# Altium project FMC_ADC_100M_10B_16CHA_TDC.PrjPCB (part 2 of 5)

## Sheet Clock_circuit.SchDoc: FMC_ADC
size 420 x 297 mm; Author: G.Kasprowicz; CompanyName: WUT ISE; DrawnBy: G.Kasprowicz; Organization: WUT ISE; Address1: PW ISE; Address2: Nowowiejska 15/19 00-665 Warsaw; Address3: gkasprow@gmail.com; Revision: 2; SheetNumber: -; SheetTotal: -; ModifiedBy: -; CheckedDate: -; Title2: Clock distribution; DivGrp: WUT ISE; Designer: G.Kasprowicz; ModifiedDate: -; ProjectName: Sensor Box
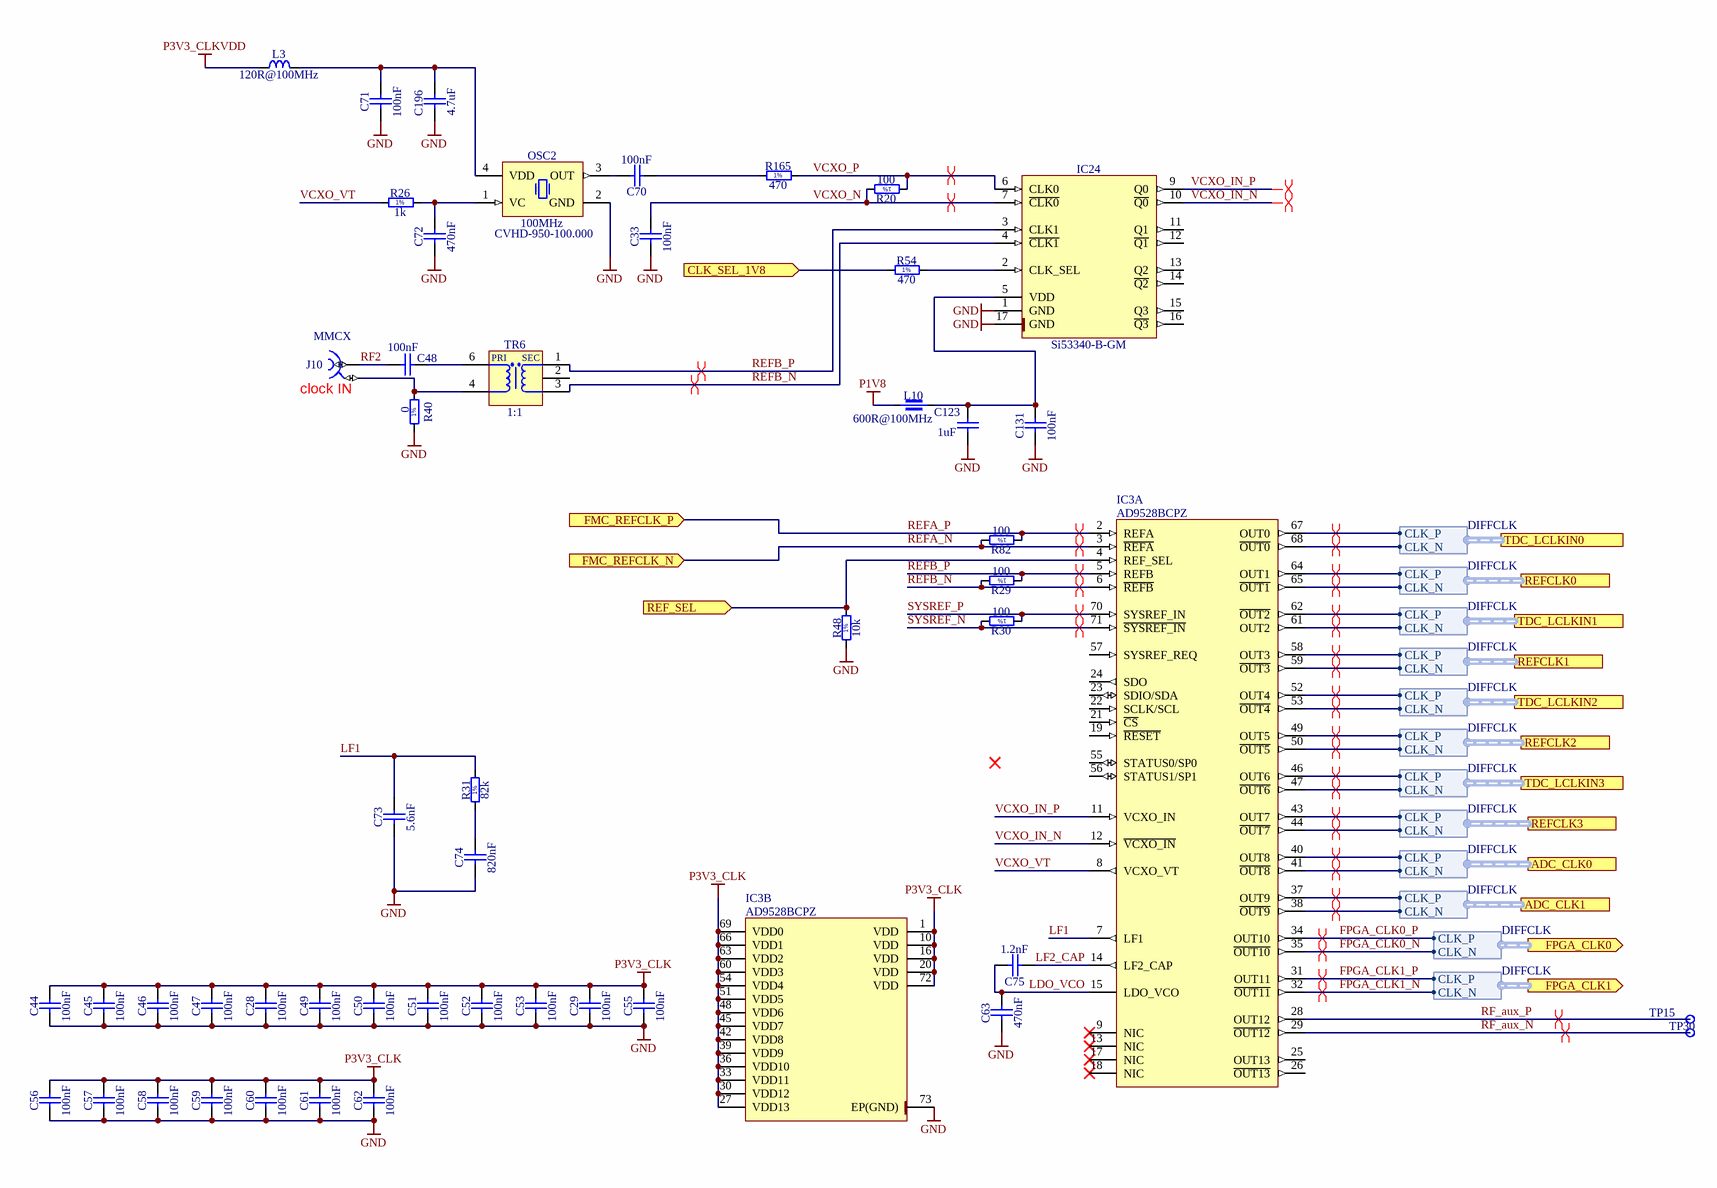
[diagram p3: Clock_circuit.SchDoc]

### Parts
C28  100nF  [CAPC0603X33N]
C29  100nF  [CAPC0603X33N]
C33  100nF  [CAPC0603X33N]
C44  100nF  [CAPC0603X33N]
C45  100nF  [CAPC0603X33N]
C46  100nF  [CAPC0603X33N]
C47  100nF  [CAPC0603X33N]
C48  100nF  [CAPC0603X33N]
C49  100nF  [CAPC0603X33N]
C50  100nF  [CAPC0603X33N]
C51  100nF  [CAPC0603X33N]
C52  100nF  [CAPC0603X33N]
C53  100nF  [CAPC0603X33N]
C55  100nF  [CAPC0603X33N]
C56  100nF  [CAPC0603X33N]
C57  100nF  [CAPC0603X33N]
C58  100nF  [CAPC0603X33N]
C59  100nF  [CAPC0603X33N]
C60  100nF  [CAPC0603X33N]
C61  100nF  [CAPC0603X33N]
C62  100nF  [CAPC0603X33N]
C63  470nF  [CAPC1005X55N]
C70  100nF  [CAPC0603X33N]
C71  100nF  [CAPC0603X33N]
C72  470nF  [CAPC1005X55N]
C73  5.6nF  [CAPC2012X88N]
C74  820nF  [CAPC3216X130N]
C75  1.2nF  [CAPC1608X80N]
C123  1uF  [CAPC1005X55N]
C131  100nF  [CAPC0603X33N]
C196  4.7uF  [CAPC1608X87N]
IC3  AD9528BCPZ  [QFN50P1000X1000X100-73N-S545]  (parts A,B of 2)
IC24  Si53340-B-GM  [QFN50P300X300X90-17N-S175]
J10  Family: MMCX  [HUBER-SUHNER_85_MMCX-50-0-1/111 OH]  (hidden comment: Coax_1Female_1Shield)
L3  120R@100MHz  [INDC1608X65N]
L10  600R@100MHz  [INDC1005X55N]
OSC2  100MHz  Manufacturer Part Number: CVHD-950-100.000  [OSC_CRYSTEK_CVHD-950]
R20  100  [RESC0603X28N]
R26  1k  [RESC1005X40N]
R29  100  [RESC0603X28N]
R30  100  [RESC0603X28N]
R31  82k  [RESC1005X40N]
R40  0  [RESC1005X40N]
R48  10k  [RESC1005X40N]
R54  470  [RESC1005X40N]
R82  100  [RESC0603X28N]
R165  470  [RESC1005X40N]
TP15  Test Point  [TPS62]  (value not drawn)
TP30  Test Point  [TPS62]  (value not drawn)
TR6  1:1  [XFMR_MINI-CIRCUITS_AT224-1]

### Ports
ADC_CLK0 (harness DIFFCLK), ADC_CLK1 (harness DIFFCLK), CLK_SEL_1V8 (in), FMC_REFCLK_N (in), FMC_REFCLK_P (in), FPGA_CLK0 (out, harness DIFFCLK), FPGA_CLK1 (out, harness DIFFCLK), REF_SEL (in), REFCLK0 (harness DIFFCLK), REFCLK1 (harness DIFFCLK), REFCLK2 (harness DIFFCLK), REFCLK3 (harness DIFFCLK), TDC_LCLKIN0 (harness DIFFCLK), TDC_LCLKIN1 (harness DIFFCLK), TDC_LCLKIN2 (harness DIFFCLK), TDC_LCLKIN3 (harness DIFFCLK)

### Harnesses
DIFFCLK: CLK_P, CLK_N

### Nets
GND: C28.1 C29.1 C33.1 C44.1 C45.1 C46.1 C47.1 C49.1 C50.1 C51.1 C52.1 C53.1 C55.1 C56.1 C57.1 C58.1 C59.1 C60.1 C61.1 C62.1 C63.1 C71.1 C72.1 C73.1 C74.1 C123.1 C131.1 C196.1 IC3.73(EP(GND)) IC24.1(GND) IC24.17(GND) OSC2.2(GND) R40.1 R48.1
P1V8: L10.1
P3V3_CLK: C28.2 C29.2 C44.2 C45.2 C46.2 C47.2 C49.2 C50.2 C51.2 C52.2 C53.2 C55.2 C56.2 C57.2 C58.2 C59.2 C60.2 C61.2 C62.2 IC3.1(VDD) IC3.10(VDD) IC3.16(VDD) IC3.20(VDD) IC3.27(VDD13) IC3.30(VDD12) IC3.33(VDD11) IC3.36(VDD10) IC3.39(VDD9) IC3.42(VDD8) IC3.45(VDD7) IC3.48(VDD6) IC3.51(VDD5) IC3.54(VDD4) IC3.60(VDD3) IC3.63(VDD2) IC3.66(VDD1) IC3.69(VDD0) IC3.72(VDD)
P3V3_CLKVDD: L3.1
ADC_CLK_N: IC3.41(~{OUT8}) ; port ADC_CLK0.CLK_N
ADC_CLK_N: IC3.38(~{OUT9}) ; port ADC_CLK1.CLK_N  [a separate net that carries the same name]
ADC_CLK_P: IC3.40(OUT8) ; port ADC_CLK0.CLK_P
ADC_CLK_P: IC3.37(OUT9) ; port ADC_CLK1.CLK_P  [a separate net that carries the same name]
FPGA_CLK0_N: IC3.35(~{OUT10}) ; port FPGA_CLK0.CLK_N  [project net CLK1_M2C_N]
FPGA_CLK0_P: IC3.34(OUT10) ; port FPGA_CLK0.CLK_P  [project net CLK1_M2C_P]
FPGA_CLK1_N: IC3.32(~{OUT11}) ; port FPGA_CLK1.CLK_N  [project net CLK0_M2C_N]
FPGA_CLK1_P: IC3.31(OUT11) ; port FPGA_CLK1.CLK_P  [project net CLK0_M2C_P]
LCLKIN_N: IC3.68(~{OUT0}) ; port TDC_LCLKIN0.CLK_N
LCLKIN_N: IC3.47(~{OUT6}) ; port TDC_LCLKIN3.CLK_N  [a separate net that carries the same name]
LCLKIN_N: IC3.53(~{OUT4}) ; port TDC_LCLKIN2.CLK_N  [a separate net that carries the same name]
LCLKIN_N: IC3.61(OUT2) ; port TDC_LCLKIN1.CLK_N  [a separate net that carries the same name]
LCLKIN_P: IC3.67(OUT0) ; port TDC_LCLKIN0.CLK_P
LCLKIN_P: IC3.46(OUT6) ; port TDC_LCLKIN3.CLK_P  [a separate net that carries the same name]
LCLKIN_P: IC3.52(OUT4) ; port TDC_LCLKIN2.CLK_P  [a separate net that carries the same name]
LCLKIN_P: IC3.62(~{OUT2}) ; port TDC_LCLKIN1.CLK_P  [a separate net that carries the same name]
LDO_VCO: C63.2 C75.2 IC3.15(LDO_VCO)
LF1: C73.2 IC3.7(LF1) R31.2
LF2_CAP: C75.1 IC3.14(LF2_CAP)
REFA_N: IC3.3(~{REFA}) R82.2 ; port FMC_REFCLK_N
REFA_P: IC3.2(REFA) R82.1 ; port FMC_REFCLK_P
REFB_N: IC3.6(~{REFB}) IC24.4(~{CLK1}) R29.2 TR6.3(S)
REFB_P: IC3.5(REFB) IC24.3(CLK1) R29.1 TR6.1(SDOT)
REFCLK_N: IC3.65(~{OUT1}) ; port REFCLK0.CLK_N
REFCLK_N: IC3.44(~{OUT7}) ; port REFCLK3.CLK_N  [a separate net that carries the same name]
REFCLK_N: IC3.50(~{OUT5}) ; port REFCLK2.CLK_N  [a separate net that carries the same name]
REFCLK_N: IC3.59(~{OUT3}) ; port REFCLK1.CLK_N  [a separate net that carries the same name]
REFCLK_P: IC3.64(OUT1) ; port REFCLK0.CLK_P
REFCLK_P: IC3.43(OUT7) ; port REFCLK3.CLK_P  [a separate net that carries the same name]
REFCLK_P: IC3.49(OUT5) ; port REFCLK2.CLK_P  [a separate net that carries the same name]
REFCLK_P: IC3.58(OUT3) ; port REFCLK1.CLK_P  [a separate net that carries the same name]
RF2: C48.2 J10.1
RF_aux_N: IC3.29(~{OUT12}) TP30.1
RF_aux_P: IC3.28(OUT12) TP15.1
SYSREF_N: IC3.71(~{SYSREF_IN}) R30.2
SYSREF_P: IC3.70(SYSREF_IN) R30.1
VCXO_IN_N: IC3.12(~{VCXO_IN}) IC24.10(~{Q0})
VCXO_IN_P: IC3.11(VCXO_IN) IC24.9(Q0)
VCXO_N: C33.2 IC24.7(~{CLK0}) R20.2
VCXO_P: IC24.6(CLK0) R20.1 R165.2
VCXO_VT: IC3.8(VCXO_VT) R26.1
NetC48_1: C48.1 TR6.6(PDOT)
NetC70_1: C70.1 R165.1
NetC70_2: C70.2 OSC2.3(OUT)
NetC71_2: C71.2 C196.2 L3.2 OSC2.4(VDD)
NetC72_2: C72.2 OSC2.1(VC) R26.2
NetC74_2: C74.2 R31.1
NetC123_2: C123.2 C131.2 IC24.5(VDD) L10.2
NetIC3_4: IC3.4(REF_SEL) R48.2 ; port REF_SEL
NetIC24_2: IC24.2(CLK_SEL) R54.2
NetIC27_8: R54.1 ; port CLK_SEL_1V8
NetJ10_2: J10.2 R40.2 TR6.4(P)

Not connected (* = marked no-connect by the designer): IC3 9(NIC)* 13(NIC)* 17(NIC)* 18(NIC)* 19(~{RESET}) 21(~{CS}) 22(SCLK/SCL) 23(SDIO/SDA) 24(SDO) 25(OUT13) 26(~{OUT13}) 55(STATUS0/SP0) 56(STATUS1/SP1) 57(SYSREF_REQ); IC24 11(Q1) 12(~{Q1}) 13(Q2) 14(~{Q2}) 15(Q3) 16(~{Q3}); TR6 2(NU)

### Layout directives
differential pair: ADC_CLK_N, ADC_CLK_P, CLK0_M2C_N, CLK0_M2C_P, CLK1_M2C_N, CLK1_M2C_P, LCLKIN_N, LCLKIN_P, REFA_N, REFA_P, REFB_N, REFB_P, REFCLK_N, REFCLK_P, RF_aux_N, RF_aux_P, SYSREF_N, SYSREF_P, VCXO_IN_N, VCXO_IN_P, VCXO_N, VCXO_P

### Notes on the sheet
- (near J10) clock IN
- Project/Equipment
- Document
- Designer
- Drawn by
- Check.by
- Copyright WUT ISE 2018.
  This documentation describes Open Hardware and is licensed under the CERN OHL v.1.1. You may redistribute and modify this documentation under the terms of the CERN OHL v.1.1. (http://ohwr.org/CERNOHL). This documentation is distributed WITHOUT ANY EXPRESS OR IMPLIED WARRANTY, INCLUDING OF MERCHANTABILITY, SATISFACTORY QUALITY AND FITNESS FOR A PARTICULAR PURPOSE. Please see the CERN OHL v.1.1 for applicable conditions.
- Contact
- File
- Last Mod.
- Print Date
- Sheet
- Size
- A3
- of
- Rev
- (in symbol R0201_100R_1%_0.05W_200PPM) 1%
- (in symbol R0402_0R_JUMPER) 1%
- (in symbol R0402_1K_1%_0.0625W_100PPM) 1%
- (in symbol R0402_10K_1%_0.0625W_100PPM) 1%
- (in symbol R0402_82K_1%_0.0625W_100PPM) 1%
- (in symbol R0402_470R_1%_0.0625W_100PPM) 1%
- (in symbol XFMR_MINI-CIRCUITS_TC1-1+) PRI; SEC

### Library data of the parts
C28 C29 C33 C44-C47 C49-C53 C55-C62 C70 C71 = CC0201_100NF_6.3V_10%_X5R: Non-polarised capacitor; Part Description: SMD Multilayer Chip Ceramic Capacitor; Manufacturer: GENERIC; Manufacturer1 Part Number: 02016D104KAT2A; Tolerance: ±10%; Voltage: 6.3V; TC: X5R; Value: 100nF; Part Number: CC0201_100NF_6.3V_10%_X5R; Component Kind: Standard; Component Type: Standard; Pin Count: 2; Status: Not Recommended; Manufacturer Part Number: CC0201_100NF_6.3V_10%_X5R; Case: 0201; Mounted: Yes; Socket: No; SMD: Yes; Sense: No; Manufacturer1 Example: AVX; Manufacturer1 ComponentHeight: 0.33mm; HelpURL: \\cern.ch\dfs\Applications\Altium\Datasheets\CC0201_X5R_AVX.pdf; Author: CERN DEM JLC; CreateDate: 03.12.2007; LatestRevisionDate: 03.12.2007
C48 = CC0201_100NF_6.3V_10%_X5R: Non-polarised capacitor; Part Description: SMD Multilayer Chip Ceramic Capacitor; Manufacturer: GENERIC; Manufacturer1 Part Number: 02016D104KAT2A; Voltage: 6.3V; TC: X5R; Tolerance: ±10%; Table: Capacitors SMD; Part Number: CC0201_100NF_6.3V_10%_X5R; Component Kind: Standard; Component Type: Standard; Pin Count: 2; Value: 100nF; Status: Not Recommended; Manufacturer Part Number: CC0201_100NF_6.3V_10%_X5R; Case: 0201; Mounted: Yes; Socket: No; SMD: Yes; Manufacturer1 Example: AVX; Manufacturer1 ComponentHeight: 0.33mm; HelpURL: \\cern.ch\dfs\Applications\Altium\Datasheets\CC0201_X5R_AVX.pdf; Author: CERN DEM JLC; CreateDate: 2007-12-03; LatestRevisionDate: 2007-12-03
C63 C72 = CC0402_470NF_6.3V_10%_X5R: Non-polarised capacitor; Part Description: SMD Multilayer Chip Ceramic Capacitor; Manufacturer: GENERIC; Manufacturer1 Part Number: GRM155R60J474KE19D; Tolerance: ±10%; Voltage: 6.3V; TC: X5R; Value: 470nF; Part Number: CC0402_470NF_6.3V_10%_X5R; Component Kind: Standard; Component Type: Standard; Pin Count: 2; Status: Preferred; Manufacturer Part Number: CC0402_470NF_6.3V_10%_X5R; Case: 0402; Mounted: Yes; Socket: No; SMD: Yes; Sense: No; Manufacturer1 Example: MURATA; Manufacturer1 ComponentHeight: 0.55mm; HelpURL: \\cern.ch\dfs\Applications\Altium\Datasheets\CC0402_X5R_MURATA_GRM.pdf; Author: CERN DEM JLC; CreateDate: 22.04.2010; LatestRevisionDate: 22.04.2010
C73 = CC0805_5.6NF_50V_5%_C0G: Non-polarised capacitor; Part Description: SMD Multilayer Chip Ceramic Capacitor; Manufacturer: GENERIC; Manufacturer1 Part Number: GRM2195C1H562JA01D; Voltage: 50V; TC: C0G/NP0; Tolerance: ±5%; Part Number: CC0805_5.6NF_50V_5%_C0G; Component Kind: Standard; Component Type: Standard; Pin Count: 2; Value: 5.6nF; Status: Preferred; Manufacturer Part Number: CC0805_5.6NF_50V_5%_C0G; Case: 0805; Mounted: Yes; Socket: No; SMD: Yes; Sense: No; Manufacturer1 Example: Murata; Manufacturer1 ComponentHeight: 0.85mm; Author: *
C74 = CC1206_820NF_25V_10%_X7R: Non-polarised capacitor; Part Description: SMD Multilayer Chip Ceramic Capacitor; Manufacturer: GENERIC; Manufacturer1 Part Number: 12063C824KAT2A; Voltage: 25V; TC: X7R; Tolerance: ±10%; Part Number: CC1206_820NF_25V_10%_X7R; Component Kind: Standard; Component Type: Standard; Pin Count: 2; Value: 820nF; Manufacturer Part Number: CC1206_820NF_25V_10%_X7R; Case: 1206; Mounted: Yes; Socket: No; SMD: Yes; Sense: No; Manufacturer1 ComponentHeight: 1.25mm; Manufacturer1 Example: AVX
C75 = CC0603_1.2NF_50V_5%_C0G: Non-polarised capacitor; Part Description: SMD Multilayer Chip Ceramic Capacitor; Manufacturer: GENERIC; Manufacturer1 Part Number: C0603C122J5GACTU; Tolerance: ±5%; Voltage: 50V; TC: C0G/NP0; Value: 1.2nF; Part Number: CC0603_1.2NF_50V_5%_C0G; Component Kind: Standard; Component Type: Standard; Pin Count: 2; Status: Preferred; Manufacturer Part Number: CC0603_1.2NF_50V_5%_C0G; Case: 0603; Mounted: Yes; Socket: No; SMD: Yes; Sense: No; Manufacturer1 Example: KEMET; Manufacturer1 ComponentHeight: 0.8mm; Author: *
C123 = CC0402_1UF_16V_10%_X5R: Non-polarised capacitor; Part Description: SMD Multilayer Chip Ceramic Capacitor; Manufacturer: GENERIC; Manufacturer1 Part Number: C1005X5R1C105KT; Voltage: 16V; TC: X5R; Tolerance: ±10%; Part Number: CC0402_1UF_16V_10%_X5R; Component Kind: Standard; Component Type: Standard; Pin Count: 2; Value: 1uF; Status: Preferred; Manufacturer Part Number: CC0402_1UF_16V_10%_X5R; Case: 0402; Mounted: Yes; Socket: No; SMD: Yes; Sense: No; Manufacturer1 Example: TDK; Manufacturer1 ComponentHeight: 0.55mm; HelpURL: \\cern.ch\dfs\Applications\Altium\Datasheets\CC0402_X5R_TDK_C.pdf; Author: CERN DEM JLC; CreateDate: 2012-10-25; LatestRevisionDate: 2012-10-25
C131 = CC0201_100NF_6.3V_10%_X5R: as C1 on sheet ADC; Part Number: CC0201_100NF_6.3V_10%_X5R; Component Kind: Standard; Component Type: Standard; Pin Count: 2; Value: 100nF; Status: Not Recommended; Manufacturer Part Number: CC0201_100NF_6.3V_10%_X5R; Case: 0201; Mounted: Yes; Socket: No; SMD: Yes; Sense: No; Manufacturer1 Example: AVX; Manufacturer1 ComponentHeight: 0.33mm; HelpURL: \\cern.ch\dfs\Applications\Altium\Datasheets\CC0201_X5R_AVX.pdf; Author: CERN DEM JLC; CreateDate: 03.12.2007; LatestRevisionDate: 03.12.2007
C196 = CC0603_4.7UF_6.3V_10%_X5R: Non-polarised capacitor; Part Description: SMD Multilayer Chip Ceramic Capacitor; Manufacturer: GENERIC; Manufacturer1 Part Number: 225520613672; Voltage: 6.3V; TC: X5R; Tolerance: ±10%; Part Number: CC0603_4.7UF_6.3V_10%_X5R; Component Kind: Standard; Component Type: Standard; Pin Count: 2; Value: 4.7uF; Status: Preferred; Manufacturer Part Number: CC0603_4.7uF_6.3V_10%_X5R; Case: 0603; Mounted: Yes; Socket: No; SMD: Yes; Manufacturer1 Example: PHYCOMP; Manufacturer1 ComponentHeight: 0.87mm; HelpURL: \\cern.ch\dfs\Applications\Altium\Datasheets\CC0805_X5R_PHYCOMP_HC.pdf; Author: CERN DEM JLC; CreateDate: 03.12.2007; LatestRevisionDate: 03.12.2007; Sense: No
IC3 = AD9528BCPZ: Clock Generator with 14 LVDS/HSTL Outputs; Manufacturer: ANALOG DEVICES; PressFit: No; Bonding: No; Part Number: AD9528BCPZ; Component Kind: Standard; Component Type: Standard; Device: AD9528BCPZ; PackageDescription: QFN,0.50mm Pitch, Square;72 Pin,10.00mm L X 10.00mm W X 1.00mm H Body (W/Thermal Tab 5.45mm X 5.45mm), IPC Medium Density; Part Description: Clock Generator with 14 LVDS/HSTL Outputs; Manufacturer Part Number: AD9528BCPZ; Pin Count: 73; Case: QFN72; Mounted: Yes; Socket: No; SMD: Yes; Sense: No; ComponentHeight: 1mm; HelpURL: \\cern.ch\dfs\Applications\Altium\Datasheets\AD9528BCPZ.pdf; Author: CERN DEM JLC; CreateDate: 11.10.2016; LatestRevisionDate: 11.10.2016
IC24 = Si53340-B-GM: Low-Jitter LVDS Fanout Clock Buffers, 10-Output,  Any-Input, Any-Frequency up to 1250MHz; Manufacturer: SILICON LABS; PressFit: No; Bonding: No; Part Number: Si53340-B-GM; Component Kind: Standard; Component Type: Standard; Device: Si53340-B-GM; PackageDescription: QFN, 0.50mm Pitch, Square; 16 Pin, 3.00mm L X 3.00mm W X 0.90mm H Body (w/thermal tab 1.75mm x 1.75mm), IPC Medium Density; Part Description: Low-Jitter LVDS Fanout Clock Buffers, 10-Output,  Any-Input, Any-Frequency up to 1250MHz; Manufacturer Part Number: Si53340-B-GM; Pin Count: 17; Case: QFN16; Mounted: Yes; Socket: No; SMD: Yes; Sense: No; ComponentHeight: 0.9mm; HelpURL: \\cern.ch\dfs\Applications\Altium\Datasheets\Si53340-B-GM.pdf; Author: CERN DEM MR; CreateDate: 04.09.2017; LatestRevisionDate: 04.09.2017
J10 = HUBER-SUHNER_85_MMCX-50-0-1/111 OH: Part Description: MMCX 50 Ohms Right Angle PCB Jack; Manufacturer: HUBER+SUHNER; Table: Miscellaneous; Part Number: HUBER-SUHNER_85_MMCX-50-0-1/111 OH; Component Kind: Standard; Component Type: Standard; Pin Count: 2; Mounted: Yes; Socket: No; SMD: No; Status: None; Manufacturer Part Number: 85_MMCX-50-0-1/111 OH; ComponentHeight: 9.6mm; HelpURL: \\cern.ch\dfs\Applications\Altium\Datasheets\HUBER-SUHNER_85_MMCX-50-0-1-111 OH.pdf; Author: CERN DEM JLC; CreateDate: 2011-10-04; LatestRevisionDate: 2011-10-04
L3 = IND0603_MURATA_BLM18SG121TN1D: Inductor; Part Description: SMD EMIFIL Suppression Chip Ferrite Bead; Manufacturer: MURATA; Power: 3A; Resistance: 0.025R; Tolerance: ±25%; Part Number: IND0603_MURATA_BLM18SG121TN1D; Component Kind: Standard; Component Type: Standard; Pin Count: 2; Value: 120R@100MHz; Status: None; Manufacturer Part Number: BLM18SG121TN1D; Case: 0603; Mounted: Yes; Socket: No; SMD: Yes; Sense: No; ComponentHeight: 0.65mm; HelpURL: \\cern.ch\dfs\Applications\Altium\Datasheets\IND0603_MURATA_BLM18S.pdf; Author: CERN DEM JLC; CreateDate: 23.07.2014; LatestRevisionDate: 23.07.2014
L10 = IND0402_MURATA_BLM15HD601SN1: Part Description: SMD EMIFIL Suppression Chip Ferrite Bead; Manufacturer: MURATA; Manufacturer Part Number: BLM15HD601SN1D; Power: 300mA; Resistance: 0.85R; Tolerance: ±25%; Part Number: IND0402_MURATA_BLM15HD601SN1; Component Kind: Standard; Component Type: Standard; Pin Count: 2; Value: 600R@100MHz; Status: None; Case: 0402; Mounted: Yes; Socket: No; SMD: Yes; Sense: No; ComponentHeight: 0.55mm; HelpURL: \\cern.ch\dfs\Applications\Altium\Datasheets\IND0402_MURATA_BLM15H.pdf; Author: CERN DEM JLC; CreateDate: 28.02.2012; LatestRevisionDate: 25.10.2018
OSC2 = OSC_125MHZ_CRYSTEK_CVHD-950-100.000: Oscillator 4 pins 1=VC 2=GND 3=OUT 4=VDD; Part Description: 3.3V, ±20ppm, 15pF, 0..70°C, CMOS Surface Mount Ultra-Low Noise Oscillator (CVHD-950 Series); Manufacturer: CRYSTEK CRYSTAL; PressFit: No; Bonding: No; Part Number: OSC_125MHZ_CRYSTEK_CVHD-950-100.000; Component Kind: Standard; Component Type: Standard; PackageDescription: Oscillator, 5.08mm Pitch; 4 Pin, 14.2mm L X 9.14mm W X 5.3mm H, CVHD-950 Serie; Value: 100MHz; Pin Count: 4; Mounted: Yes; Socket: No; SMD: Yes; ComponentHeight: 5.3mm; HelpURL: \\cern.ch\dfs\Applications\Altium\Datasheets\OSC_CRYSTEK_CVHD-950.pdf; Author: CERN DEM JLC; CreateDate: 09.10.2012; LatestRevisionDate: 09.10.2012; Sense: No
R20 R29 R30 R82 = R0201_100R_1%_0.05W_200PPM: Resistor - 1%; Part Description: Thick Film Chip Resistor; Manufacturer: GENERIC; Manufacturer1 Part Number: CRCW0201100RFNED; Power: 0.05W; TC: ±200ppm/°C; PressFit: No; Part Number: R0201_100R_1%_0.05W_200PPM; Component Kind: Standard; Component Type: Standard; Pin Count: 2; Value: 100; Status: Not Recommended; Tolerance: ±1%; Manufacturer Part Number: R0201_100R_1%_0.05W_200PPM; Case: 0201; Mounted: Yes; Socket: No; SMD: Yes; Manufacturer1 Example: VISHAY; Manufacturer1 ComponentHeight: 0.27mm; HelpURL: \\cern.ch\dfs\Applications\Altium\Datasheets\R0201_VISHAY_CRCW0201 e3.pdf; Author: CERN DEM JLC; CreateDate: 13.11.2014; LatestRevisionDate: 13.11.2014; Sense: No
R26 = R0402_1K_1%_0.0625W_100PPM: Resistor - 1%; Part Description: General Purpose Thick Film Chip Resistor; Manufacturer: GENERIC; Manufacturer1 Part Number: 232270671002L; TC: ±100ppm/°C; Tolerance: ±1%; Value: 1k; Power: 0.0625W; Part Number: R0402_1K_1%_0.0625W_100PPM; Component Kind: Standard; Component Type: Standard; Pin Count: 2; Status: Not recommended; Manufacturer Part Number: R0402_1K_1%_0.0625W_100PPM; Case: 0402; Mounted: Yes; Sense: No; Socket: No; SMD: Yes; Manufacturer1 Example: YAGEO PHYCOMP; Manufacturer1 ComponentHeight: 0.4mm; HelpURL: \\cern.ch\dfs\Applications\Altium\Datasheets\R0402_Phycomp_RC0402.pdf; Author: CERN DEM JLC; CreateDate: 03.12.2007; LatestRevisionDate: 17.10.2012
R31 = R0402_82K_1%_0.0625W_100PPM: Resistor - 1%; Part Description: General Purpose Thick Film Chip Resistor; Manufacturer: GENERIC; Manufacturer1 Part Number: 232270678203L; TC: ±100ppm/°C; Value: 82k; Tolerance: ±1%; Power: 0.0625W; Part Number: R0402_82K_1%_0.0625W_100PPM; Component Kind: Standard; Component Type: Standard; Pin Count: 2; Status: Not recommended; Manufacturer Part Number: R0402_82K_1%_0.0625W_100PPM; Case: 0402; Mounted: Yes; Sense: No; Socket: No; SMD: Yes; Manufacturer1 Example: YAGEO PHYCOMP; Manufacturer1 ComponentHeight: 0.4mm; HelpURL: \\cern.ch\dfs\Applications\Altium\Datasheets\R0402_Phycomp_RC0402.pdf; Author: CERN DEM JLC; CreateDate: 03.12.2007; LatestRevisionDate: 17.10.2012
R40 = R0402_0R_JUMPER: Resistor - 1%; Part Description: 1A (0.05R Max DC Resistance) Zero Ohm Jumper; Manufacturer: GENERIC; Manufacturer1 Part Number: 232270591001L; Table: Resistors SMD; Part Number: R0402_0R_JUMPER; Component Kind: Standard; Component Type: Standard; Pin Count: 2; Value: 0; Status: Not recommended; Manufacturer Part Number: R0402_0R_JUMPER; Case: 0402; Mounted: Yes; Socket: No; SMD: Yes; Manufacturer1 Example: YAGEO PHYCOMP; Manufacturer1 ComponentHeight: 0.4mm; HelpURL: \\cern.ch\dfs\Applications\Altium\Datasheets\R0402_Phycomp_RC0402.pdf; Author: CERN DEM JLC; CreateDate: 3/12/2007; LatestRevisionDate: 17/10/2012
R48 = R0402_10K_1%_0.0625W_100PPM: Resistor - 1%; Part Description: General Purpose Thick Film Chip Resistor; Manufacturer: GENERIC; Manufacturer1 Part Number: 232270671003L; TC: ±100ppm/°C; Table: Resistors SMD; Part Number: R0402_10K_1%_0.0625W_100PPM; Component Kind: Standard; Component Type: Standard; Pin Count: 2; Value: 10k; Status: Not recommended; Power: 0.0625W; Tolerance: ±1%; Manufacturer Part Number: R0402_10K_1%_0.0625W_100PPM; Case: 0402; Mounted: Yes; Socket: No; SMD: Yes; Manufacturer1 Example: YAGEO PHYCOMP; Manufacturer1 ComponentHeight: 0.4mm; HelpURL: \\cern.ch\dfs\Applications\Altium\Datasheets\R0402_Phycomp_RC0402.pdf; Author: CERN DEM JLC; CreateDate: 3/12/2007; LatestRevisionDate: 17/10/2012
R54 R165 = R0402_470R_1%_0.0625W_100PPM: Resistor - 1%; Part Description: General Purpose Thick Film Chip Resistor; Manufacturer: GENERIC; Manufacturer1 Part Number: 232270674701L; TC: ±100ppm/°C; PressFit: No; Part Number: R0402_470R_1%_0.0625W_100PPM; Component Kind: Standard; Component Type: Standard; Pin Count: 2; Value: 470; Status: Not Recommended; Power: 0.0625W; Tolerance: ±1%; Manufacturer Part Number: R0402_470R_1%_0.0625W_100PPM; Case: 0402; Mounted: Yes; Sense: No; Socket: No; SMD: Yes; Manufacturer1 Example: YAGEO PHYCOMP; Manufacturer1 ComponentHeight: 0.4mm; HelpURL: \\cern.ch\dfs\Applications\Altium\Datasheets\R0402_Phycomp_RC0402.pdf; Author: CERN DEM JLC; CreateDate: 03.12.2007; LatestRevisionDate: 17.10.2012
TP15 TP30 = SMD_PAD_0.62X0.62MM: Part Description: 0.62mm x 0.62mm PCB Copper Area (SMD Test Point); Mounted: No; Part Number: SMD_PAD_0.62X0.62MM; Component Kind: Standard (No BOM); Component Type: Standard (No BOM); Pin Count: 1; Family: Test Point; Socket: No; SMD: Yes; Sense: No; Status: None; ComponentHeight: 0mm; HelpURL: Undefined; Author: CERN DEM JLC; CreateDate: 12.01.2008; LatestRevisionDate: 12.01.2008; PackageDescription: 0.62mm x 0.62mm PCB Copper Area (SMD Test Point)
TR6 = XFMR_MINI-CIRCUITS_TC1-1+: 50 Ohm  0.4 To 500MHz RF Transformers; Part Number: XFMR_MINI-CIRCUITS_TC1-1T+; Part Description: 50 Ohms 1.5 to 500 MHz RF Transformer; Manufacturer Part Number: TC1-1T+; Component Kind: Standard; Component Type: Standard; Pin Count: 5; Value: 1:1; Status: None; Manufacturer: MINI-CIRCUITS; Mounted: Yes; Socket: No; SMD: Yes; ComponentHeight: 4.06mm; HelpURL: \\cern.ch\dfs\Applications\Altium\Datasheets\XFMR_MINI-CIRCUITS_TC1-1+.pdf; Author: CERN DEM JLC; CreateDate: 2010-02-08; LatestRevisionDate: 2010-04-27; Table: Transformers

## Sheet EEPROM_Temp.SchDoc: FMC_ADC
size 420 x 297 mm; Author: G.Kasprowicz; CompanyName: WUT ISE; DrawnBy: G.Kasprowicz; Organization: WUT ISE; Address1: PW ISE; Address2: Nowowiejska 15/19 00-665 Warsaw; Address3: gkasprow@gmail.com; Revision: 2; SheetNumber: -; SheetTotal: -; ModifiedBy: -; CheckedDate: -; Title2: EEPROM, temperature sensor; DivGrp: WUT ISE; Designer: G.Kasprowicz; ModifiedDate: -; ProjectName: Sensor Box
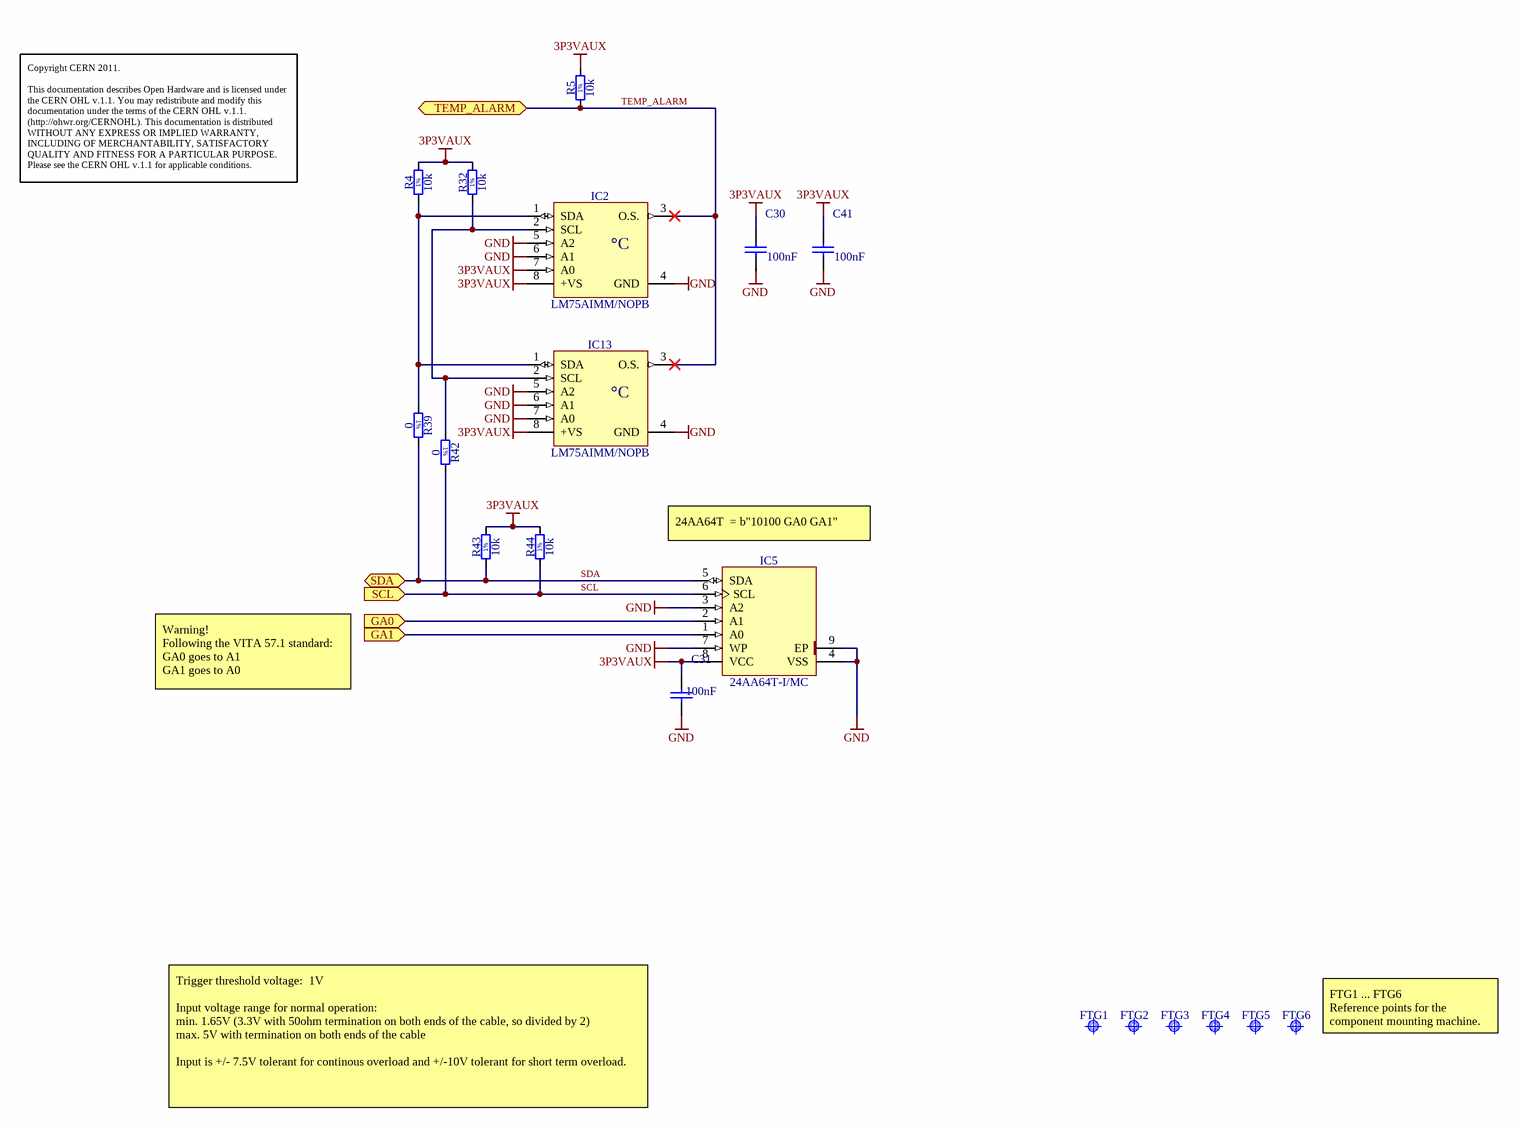
[diagram p4: EEPROM_Temp.SchDoc]

### Parts
C30  100nF  [CAPC0603X33N]
C31  100nF  [CAPC0603X33N]
C41  100nF  [CAPC0603X33N]
FTG1  Use only in PCB  [FIDUCIAL_TOP_S100-200]  (value not drawn)
FTG2  Use only in PCB  [FIDUCIAL_TOP_S100-200]  (value not drawn)
FTG3  Use only in PCB  [FIDUCIAL_TOP_S100-200]  (value not drawn)
FTG4  Use only in PCB  [FIDUCIAL_TOP_S100-200]  (value not drawn)
FTG5  Use only in PCB  [FIDUCIAL_TOP_S100-200]  (value not drawn)
FTG6  Use only in PCB  [FIDUCIAL_TOP_S100-200]  (value not drawn)
IC2  LM75AIMM/NOPB  [SOP65P490X109-8N]
IC5  24AA64T-I/MC  [SON50P300X200X100-9N-S175X155]
IC13  LM75AIMM/NOPB  [SOP65P490X109-8N]
R4  10k  [RESC1005X40N]
R5  10k  [RESC1005X40N]
R32  10k  [RESC1005X40N]
R39  0  [RESC1005X40N]
R42  0  [RESC1005X40N]
R43  10k  [RESC1005X40N]
R44  10k  [RESC1005X40N]

### Ports
GA0 (in), GA1 (in), SCL (in), SDA (bidir), TEMP_ALARM (bidir)

### Nets
3P3VAUX: C30.1 C31.1 C41.1 IC2.7(A0) IC2.8(+VS) IC5.8(VCC) IC13.8(+VS) R4.2 R5.2 R32.2 R43.2 R44.2
GND: C30.2 C31.2 C41.2 IC2.4(GND) IC2.5(A2) IC2.6(A1) IC5.3(A2) IC5.4(VSS) IC5.7(WP) IC5.9(EP) IC13.4(GND) IC13.5(A2) IC13.6(A1) IC13.7(A0)
GA0: IC5.2(A1) ; port GA0
GA1: IC5.1(A0) ; port GA1
SCL: IC5.6(SCL) R42.2 R44.1 ; port SCL
SDA: IC5.5(SDA) R39.2 R43.1 ; port SDA
TEMP_ALARM: IC2.3(O.S.) IC13.3(O.S.) R5.1 ; port TEMP_ALARM
NetIC2_1: IC2.1(SDA) IC13.1(SDA) R4.1 R39.1
NetIC2_2: IC2.2(SCL) IC13.2(SCL) R32.1 R42.1

### Notes on the sheet
- Copyright CERN 2011.
  This documentation describes Open Hardware and is licensed under the CERN OHL v.1.1. You may redistribute and modify this documentation under the terms of the CERN OHL v.1.1. (http://ohwr.org/CERNOHL). This documentation is distributed WITHOUT ANY EXPRESS OR IMPLIED WARRANTY, INCLUDING OF MERCHANTABILITY, SATISFACTORY QUALITY AND FITNESS FOR A PARTICULAR PURPOSE. Please see the CERN OHL v.1.1 for applicable conditions.
- (near IC5) 24AA64T  = b"10100 GA0 GA1"
- Warning!
  Following the VITA 57.1 standard:
  GA0 goes to A1
  GA1 goes to A0
- (near FTG6) FTG1 ... FTG6
  Reference points for the component mounting machine.
- Trigger threshold voltage:  1V
  Input voltage range for normal operation:
  min. 1.65V (3.3V with 50ohm termination on both ends of the cable, so divided by 2)
  max. 5V with termination on both ends of the cable
  Input is +/- 7.5V tolerant for continous overload and +/-10V tolerant for short term overload.
- Project/Equipment
- Document
- Designer
- Drawn by
- Check.by
- Copyright WUT ISE 2018.
  This documentation describes Open Hardware and is licensed under the CERN OHL v.1.1. You may redistribute and modify this documentation under the terms of the CERN OHL v.1.1. (http://ohwr.org/CERNOHL). This documentation is distributed WITHOUT ANY EXPRESS OR IMPLIED WARRANTY, INCLUDING OF MERCHANTABILITY, SATISFACTORY QUALITY AND FITNESS FOR A PARTICULAR PURPOSE. Please see the CERN OHL v.1.1 for applicable conditions.
- Contact
- File
- Last Mod.
- Print Date
- Sheet
- Size
- A3
- of
- Rev
- (in symbol LM75AIMM/NOPB) °C
- (in symbol R0402_0R_JUMPER) 1%
- (in symbol R0402_10K_1%_0.0625W_100PPM) 1%

### Library data of the parts
C30 C31 C41 = CC0201_100NF_6.3V_10%_X5R: as C48 on sheet Clock_circuit; Part Number: CC0201_100NF_6.3V_10%_X5R; Component Kind: Standard; Component Type: Standard; Pin Count: 2; Value: 100nF; Status: Not Recommended; Manufacturer Part Number: CC0201_100NF_6.3V_10%_X5R; Case: 0201; Mounted: Yes; Socket: No; SMD: Yes; Manufacturer1 Example: AVX; Manufacturer1 ComponentHeight: 0.33mm; HelpURL: \\cern.ch\dfs\Applications\Altium\Datasheets\CC0201_X5R_AVX.pdf; Author: CERN DEM JLC; CreateDate: 2007-12-03; LatestRevisionDate: 2007-12-03
FTG1-FTG6 = FIDUCIAL_TARGET_S100-200: Fiducial Target; Part Description: Square Fiducial Target, Top Layer, 1.0mm, Top Solder 2.0mm, Keepout =2.0mm; Mounted: No; Table: Pads; Part Number: FIDUCIAL_TARGET_S100-200; Component Kind: Standard (No BOM); Component Type: Standard (No BOM); Pin Count: 1; Family: Fiducial; Socket: No; SMD: Yes; Status: None; ComponentHeight: 0mm; Author: CERN DEM JLC; CreateDate: 9/2/2010; LatestRevisionDate: 4/4/2012; PackageDescription: Square Fiducial Target, Top Layer, 1.0mm, Top Solder 2.0mm, Keepout =2.0mm
IC2 IC13 = LM75AIMM/NOPB: Digital Temperature Sensor and Thermal Watchdog with Two-Wire Interface; Part Description: -25° to +100°C ±2°C Digital Temperature Sensor and Thermal Watchdog with Two-Wire Interface; Manufacturer: TEXAS INSTRUMENTS; Table: Sensors; Part Number: LM75AIMM/NOPB; Component Kind: Standard; Component Type: Standard; Device: LM75AIMM/NOPB; PackageDescription: SOP, 0.65mm pitch; 8 pin,3.00mm W X 3.00mm L X 1.09mm H bodyI, PC Medium Density; Manufacturer Part Number: LM75AIMM/NOPB; Pin Count: 8; Case: SSOP8; Mounted: Yes; Socket: No; SMD: Yes; ComponentHeight: 1.09mm; HelpURL: \\cern.ch\dfs\Applications\Altium\Datasheets\LM75AIMM-NOPB.pdf; Author: CERN DEM JLC; CreateDate: 2012-10-15; LatestRevisionDate: 2012-10-15
IC5 = 24AA64T-I/MC: 1.7-5.5V 64K I2C Serial EEPROM; Part Description: 1.7V-5.5V, 64K  (8K x 8-bit) I2C Serial EEPROM; Manufacturer: MICROCHIP TECHNOLOGY; Table: Logic; Part Number: 24AA64T-I/MC; Component Kind: Standard; Component Type: Standard; Device: 24AA64T-I/MC; PackageDescription: SON (DFN), 0.50mm pitch, 8 pin, 2mm X 3mm X 1.00mm H body (w/thermal tab 1.75 X 1.55mm),  IPC Medium Density; Manufacturer Part Number: 24AA64T-I/MC; Pin Count: 9; Case: DFN8; Mounted: Yes; Socket: No; SMD: Yes; ComponentHeight: 1.0mm; HelpURL: \\cern.ch\dfs\Applications\Altium\Datasheets\24AA64T-I-MC.pdf; Author: CERN DEM JLC; CreateDate: 18/11/2009; LatestRevisionDate: 24/1/2011
R4 R5 R32 R43 R44 = R0402_10K_1%_0.0625W_100PPM: as R48 on sheet Clock_circuit; Part Number: R0402_10K_1%_0.0625W_100PPM; Component Kind: Standard; Component Type: Standard; Pin Count: 2; Value: 10k; Status: Not recommended; Power: 0.0625W; Tolerance: ±1%; Manufacturer Part Number: R0402_10K_1%_0.0625W_100PPM; Case: 0402; Mounted: Yes; Socket: No; SMD: Yes; Manufacturer1 Example: YAGEO PHYCOMP; Manufacturer1 ComponentHeight: 0.4mm; HelpURL: \\cern.ch\dfs\Applications\Altium\Datasheets\R0402_Phycomp_RC0402.pdf; Author: CERN DEM JLC; CreateDate: 3/12/2007; LatestRevisionDate: 17/10/2012
R39 R42 = R0402_0R_JUMPER: Resistor - 1%; Part Description: 1A (0.05R Max DC Resistance) Zero Ohm Jumper; Manufacturer: GENERIC; Manufacturer1 Part Number: 232270591001; Table: Resistors SMD; Part Number: R0402_0R_JUMPER; Component Kind: Standard; Component Type: Standard; Pin Count: 2; Value: 0; Status: Not recommended; Manufacturer Part Number: R0402_0R_JUMPER; Case: 0402; Mounted: Yes; Socket: No; SMD: Yes; Manufacturer1 Example: PHYCOMP; Manufacturer1 ComponentHeight: 0.4mm; HelpURL: \\cern.ch\dfs\Applications\Altium\Datasheets\R0402_Phycomp_RC0402.pdf; Author: CERN DEM JLC; CreateDate: 2007-12-03; LatestRevisionDate: 2008-03-13

## Sheet FMC connector.SchDoc: FMC_ADC
size 420 x 297 mm; Author: G.Kasprowicz; CompanyName: WUT ISE; DrawnBy: G.Kasprowicz; Organization: WUT ISE; Address1: PW ISE; Address2: Nowowiejska 15/19 00-665 Warsaw; Address3: gkasprow@gmail.com; Revision: 2; SheetNumber: -; SheetTotal: -; ModifiedBy: -; CheckedDate: -; Title2: FMC HPC connector; DivGrp: WUT ISE; Designer: G.Kasprowicz; ModifiedDate: -; ProjectName: Sensor Box
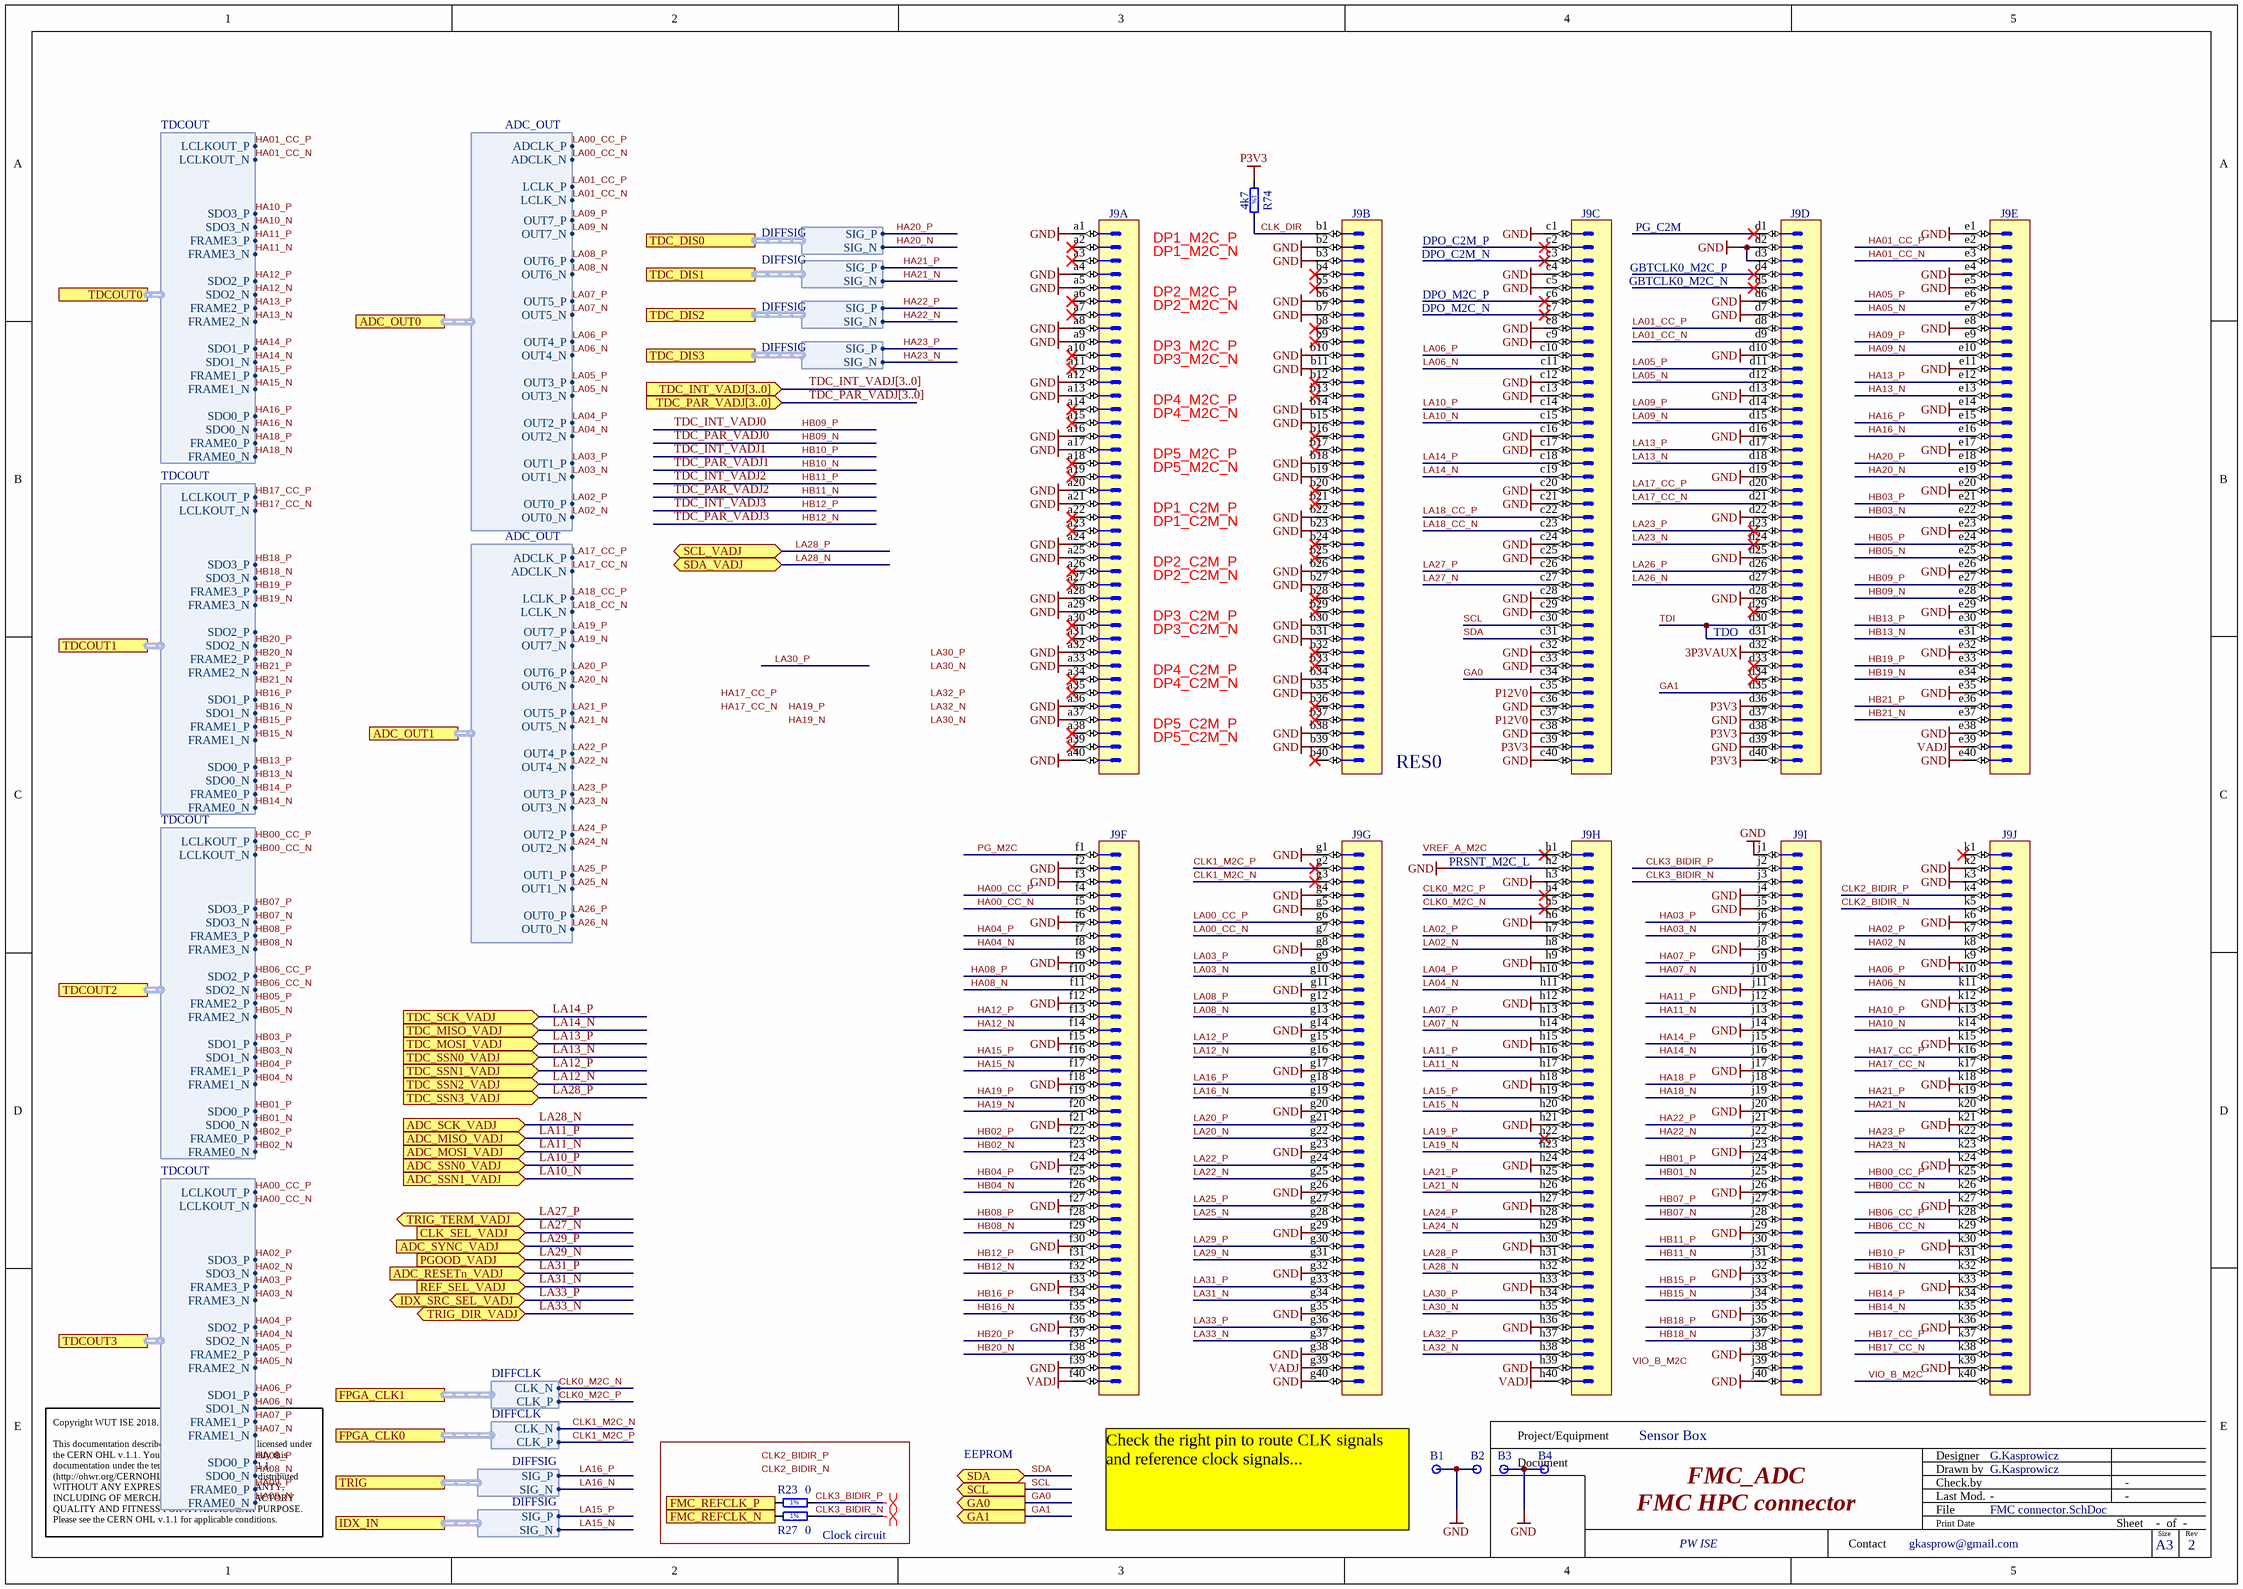
[diagram p5: FMC connector.SchDoc]

### Parts
B1  Plated Hole  [MTG300_600]  (value not drawn)
B2  Plated Hole  [MTG300_600]  (value not drawn)
B3  Plated Hole  [MTG300_600]  (value not drawn)
B4  Plated Hole  [MTG300_600]  (value not drawn)
J9  VITA 57  [SAMTEC_ASP-134488-01]  (value not drawn)  (parts A,B,C,D,E,F,G,H,I,J of 10)
R23  0  [RESC1005X40N]
R27  0  [RESC1005X40N]
R74  4k7  [RESC1608X55N]

### Blocks framed on the sheet
Clock circuit: R23 R27

### Ports
ADC_MISO_VADJ (in), ADC_MOSI_VADJ (in), ADC_OUT0 (harness ADC_OUT), ADC_OUT1 (harness ADC_OUT), ADC_RESETn_VADJ (in), ADC_SCK_VADJ (in), ADC_SSN0_VADJ (in), ADC_SSN1_VADJ (in), ADC_SYNC_VADJ (in), CLK_SEL_VADJ (in), FMC_REFCLK_N (out), FMC_REFCLK_P (out), FPGA_CLK0 (harness DIFFCLK), FPGA_CLK1 (harness DIFFCLK), GA0 (out), GA1 (out), IDX_IN (harness DIFFSIG), IDX_SRC_SEL_VADJ (bidir), PGOOD_VADJ (in), REF_SEL_VADJ (in), SCL (out), SCL_VADJ (bidir), SDA (bidir), SDA_VADJ (bidir), TDC_DIS0 (harness DIFFSIG), TDC_DIS1 (harness DIFFSIG), TDC_DIS2 (harness DIFFSIG), TDC_DIS3 (harness DIFFSIG), TDC_INT_VADJ[3..0] (in), TDC_MISO_VADJ (in), TDC_MOSI_VADJ (in), TDC_PAR_VADJ[3..0] (in), TDC_SCK_VADJ (in), TDC_SSN0_VADJ (in), TDC_SSN1_VADJ (in), TDC_SSN2_VADJ (in), TDC_SSN3_VADJ (in), TDCOUT0 (harness TDCOUT), TDCOUT1 (harness TDCOUT), TDCOUT2 (harness TDCOUT), TDCOUT3 (harness TDCOUT), TRIG (harness DIFFSIG), TRIG_DIR_VADJ (bidir), TRIG_TERM_VADJ (bidir)

### Harnesses
TDCOUT: FRAME0_N, FRAME0_P, SDO0_N, SDO0_P, FRAME1_N, FRAME1_P, SDO1_N, SDO1_P, FRAME2_N, FRAME2_P, SDO2_N, SDO2_P, FRAME3_N, FRAME3_P, SDO3_N, SDO3_P, LCLKOUT_N, LCLKOUT_P
ADC_OUT: LCLK_N, ADCLK_N, OUT7_N, OUT6_N, OUT5_N, OUT4_N, OUT3_N, OUT2_N, OUT1_N, OUT0_N, LCLK_P, ADCLK_P, OUT7_P, OUT6_P, OUT5_P, OUT4_P, OUT3_P, OUT2_P, OUT1_P, OUT0_P
DIFFCLK: CLK_P, CLK_N
DIFFSIG: SIG_N, SIG_P

### Nets
3P3VAUX: J9.d32
GND: B1.1 B2.1 B3.1 B4.1 J9.a1 J9.a4 J9.a5 J9.a8 J9.a9 J9.a12 J9.a13 J9.a16 J9.a17 J9.a20 J9.a21 J9.a24 J9.a25 J9.a28 J9.a29 J9.a32 J9.a33 J9.a36 J9.a37 J9.a40 J9.b2 J9.b3 J9.b6 J9.b7 J9.b10 J9.b11 J9.b14 J9.b15 J9.b18 J9.b19 J9.b22 J9.b23 J9.b26 J9.b27 J9.b30 J9.b31 J9.b34 J9.b35 J9.b38 J9.b39 J9.c1 J9.c4 J9.c5 J9.c8 J9.c9 J9.c12 J9.c13 J9.c16 J9.c17 J9.c20 J9.c21 J9.c24 J9.c25 J9.c28 J9.c29 J9.c32 J9.c33 J9.c36 J9.c38 J9.c40 J9.d2 J9.d3 J9.d6 J9.d7 J9.d10 J9.d13 J9.d16 J9.d19 J9.d22 J9.d25 J9.d28 J9.d37 J9.d39 J9.e1 J9.e4 J9.e5 J9.e8 J9.e11 J9.e14 J9.e17 J9.e20 J9.e23 J9.e26 J9.e29 J9.e32 J9.e35 J9.e38 J9.e40 J9.f2 J9.f3 J9.f6 J9.f9 J9.f12 J9.f15 J9.f18 J9.f21 J9.f24 J9.f27 J9.f30 J9.f33 J9.f36 J9.f39 J9.g1 J9.g4 J9.g5 J9.g8 J9.g11 J9.g14 J9.g17 J9.g20 J9.g23 J9.g26 J9.g29 J9.g32 J9.g35 J9.g38 J9.g40 J9.h2 J9.h3 J9.h6 J9.h9 J9.h12 J9.h15 J9.h18 J9.h21 J9.h24 J9.h27 J9.h30 J9.h33 J9.h36 J9.h39 J9.j1 J9.j4 J9.j5 J9.j8 J9.j11 J9.j14 J9.j17 J9.j20 J9.j23 J9.j26 J9.j29 J9.j32 J9.j35 J9.j38 J9.j40 J9.k2 J9.k3 J9.k6 J9.k9 J9.k12 J9.k15 J9.k18 J9.k21 J9.k24 J9.k27 J9.k30 J9.k33 J9.k36 J9.k39
P3V3: J9.c39 J9.d36 J9.d38 J9.d40 R74.1
P12V0: J9.c35 J9.c37
VADJ: J9.e39 J9.f40 J9.g39 J9.h40
CLK0_M2C_N: J9.h5 ; port FPGA_CLK1.CLK_N
CLK0_M2C_P: J9.h4 ; port FPGA_CLK1.CLK_P
CLK1_M2C_N: J9.g3 ; port FPGA_CLK0.CLK_N
CLK1_M2C_P: J9.g2 ; port FPGA_CLK0.CLK_P
CLK2_BIDIR_N: J9.k5
CLK2_BIDIR_P: J9.k4
CLK3_BIDIR_N: J9.j3 R27.2
CLK3_BIDIR_P: J9.j2 R23.2
CLK_DIR: J9.b1 R74.2
GA0: J9.c34 ; port GA0
GA1: J9.d35 ; port GA1
HA00_CC_N: J9.f5 ; port TDCOUT3.LCLKOUT_N
HA00_CC_P: J9.f4 ; port TDCOUT3.LCLKOUT_P
HA01_CC_N: J9.e3 ; port TDCOUT0.LCLKOUT_N
HA01_CC_P: J9.e2 ; port TDCOUT0.LCLKOUT_P
HA02_N: J9.k8 ; port TDCOUT3.SDO3_N
HA02_P: J9.k7 ; port TDCOUT3.SDO3_P
HA03_N: J9.j7 ; port TDCOUT3.FRAME3_N  [project net FRAME3_N]
HA03_P: J9.j6 ; port TDCOUT3.FRAME3_P  [project net FRAME3_P]
HA04_N: J9.f8 ; port TDCOUT3.SDO2_N
HA04_P: J9.f7 ; port TDCOUT3.SDO2_P
HA05_N: J9.e7 ; port TDCOUT3.FRAME2_N  [project net FRAME2_N]
HA05_P: J9.e6 ; port TDCOUT3.FRAME2_P  [project net FRAME2_P]
HA06_N: J9.k11 ; port TDCOUT3.SDO1_N
HA06_P: J9.k10 ; port TDCOUT3.SDO1_P
HA07_N: J9.j10 ; port TDCOUT3.FRAME1_N  [project net FRAME1_N]
HA07_P: J9.j9 ; port TDCOUT3.FRAME1_P  [project net FRAME1_P]
HA08_N: J9.f11 ; port TDCOUT3.SDO0_N
HA08_P: J9.f10 ; port TDCOUT3.SDO0_P
HA09_N: J9.e10 ; port TDCOUT3.FRAME0_N  [project net FRAME0_N]
HA09_P: J9.e9 ; port TDCOUT3.FRAME0_P  [project net FRAME0_P]
HA10_N: J9.k14 ; port TDCOUT0.SDO3_N
HA10_P: J9.k13 ; port TDCOUT0.SDO3_P
HA11_N: J9.j13 ; port TDCOUT0.FRAME3_N  [project net FRAME3_N]
HA11_P: J9.j12 ; port TDCOUT0.FRAME3_P  [project net FRAME3_P]
HA12_N: J9.f14 ; port TDCOUT0.SDO2_N
HA12_P: J9.f13 ; port TDCOUT0.SDO2_P
HA13_N: J9.e13 ; port TDCOUT0.FRAME2_N  [project net FRAME2_N]
HA13_P: J9.e12 ; port TDCOUT0.FRAME2_P  [project net FRAME2_P]
HA14_N: J9.j16 ; port TDCOUT0.SDO1_N
HA14_P: J9.j15 ; port TDCOUT0.SDO1_P
HA15_N: J9.f17 ; port TDCOUT0.FRAME1_N  [project net FRAME1_N]
HA15_P: J9.f16 ; port TDCOUT0.FRAME1_P  [project net FRAME1_P]
HA16_N: J9.e16 ; port TDCOUT0.SDO0_N
HA16_P: J9.e15 ; port TDCOUT0.SDO0_P
HA17_CC_N: J9.k17
HA17_CC_P: J9.k16
HA18_N: J9.j19 ; port TDCOUT0.FRAME0_N  [project net FRAME0_N]
HA18_P: J9.j18 ; port TDCOUT0.FRAME0_P  [project net FRAME0_P]
HA19_N: J9.f20
HA19_P: J9.f19
HA20_N: J9.e19 ; port TDC_DIS0.SIG_N  [project net DISABLE_N]
HA20_P: J9.e18 ; port TDC_DIS0.SIG_P  [project net DISABLE_P]
HA21_N: J9.k20 ; port TDC_DIS1.SIG_N  [project net DISABLE_N]
HA21_P: J9.k19 ; port TDC_DIS1.SIG_P  [project net DISABLE_P]
HA22_N: J9.j22 ; port TDC_DIS2.SIG_N  [project net DISABLE_N]
HA22_P: J9.j21 ; port TDC_DIS2.SIG_P  [project net DISABLE_P]
HA23_N: J9.k23 ; port TDC_DIS3.SIG_N  [project net DISABLE_N]
HA23_P: J9.k22 ; port TDC_DIS3.SIG_P  [project net DISABLE_P]
HB00_CC_N: J9.k26 ; port TDCOUT2.LCLKOUT_N
HB00_CC_P: J9.k25 ; port TDCOUT2.LCLKOUT_P
HB01_N: J9.j25 ; port TDCOUT2.SDO0_N
HB01_P: J9.j24 ; port TDCOUT2.SDO0_P
HB02_N: J9.f23 ; port TDCOUT2.FRAME0_N  [project net FRAME0_N]
HB02_P: J9.f22 ; port TDCOUT2.FRAME0_P  [project net FRAME0_P]
HB03_N: J9.e22 ; port TDCOUT2.SDO1_N
HB03_P: J9.e21 ; port TDCOUT2.SDO1_P
HB04_N: J9.f26 ; port TDCOUT2.FRAME1_N  [project net FRAME1_N]
HB04_P: J9.f25 ; port TDCOUT2.FRAME1_P  [project net FRAME1_P]
HB05_N: J9.e25 ; port TDCOUT2.FRAME2_N  [project net FRAME2_N]
HB05_P: J9.e24 ; port TDCOUT2.FRAME2_P  [project net FRAME2_P]
HB06_CC_N: J9.k29 ; port TDCOUT2.SDO2_N
HB06_CC_P: J9.k28 ; port TDCOUT2.SDO2_P
HB07_N: J9.j28 ; port TDCOUT2.SDO3_N
HB07_P: J9.j27 ; port TDCOUT2.SDO3_P
HB08_N: J9.f29 ; port TDCOUT2.FRAME3_N  [project net FRAME3_N]
HB08_P: J9.f28 ; port TDCOUT2.FRAME3_P  [project net FRAME3_P]
HB09_N: J9.e28  [also labelled TDC_PAR_VADJ0]
HB09_P: J9.e27  [also labelled TDC_INT_VADJ0]
HB10_N: J9.k32  [also labelled TDC_PAR_VADJ1]
HB10_P: J9.k31  [also labelled TDC_INT_VADJ1]
HB11_N: J9.j31  [also labelled TDC_PAR_VADJ2]
HB11_P: J9.j30  [also labelled TDC_INT_VADJ2]
HB12_N: J9.f32  [also labelled TDC_PAR_VADJ3]
HB12_P: J9.f31  [also labelled TDC_INT_VADJ3]
HB13_N: J9.e31 ; port TDCOUT1.SDO0_N
HB13_P: J9.e30 ; port TDCOUT1.SDO0_P
HB14_N: J9.k35 ; port TDCOUT1.FRAME0_N  [project net FRAME0_N]
HB14_P: J9.k34 ; port TDCOUT1.FRAME0_P  [project net FRAME0_P]
HB15_N: J9.j34 ; port TDCOUT1.FRAME1_N  [project net FRAME1_N]
HB15_P: J9.j33 ; port TDCOUT1.FRAME1_P  [project net FRAME1_P]
HB16_N: J9.f35 ; port TDCOUT1.SDO1_N
HB16_P: J9.f34 ; port TDCOUT1.SDO1_P
HB17_CC_N: J9.k38 ; port TDCOUT1.LCLKOUT_N
HB17_CC_P: J9.k37 ; port TDCOUT1.LCLKOUT_P
HB18_N: J9.j37 ; port TDCOUT1.SDO3_N
HB18_P: J9.j36 ; port TDCOUT1.SDO3_P
HB19_N: J9.e34 ; port TDCOUT1.FRAME3_N  [project net FRAME3_N]
HB19_P: J9.e33 ; port TDCOUT1.FRAME3_P  [project net FRAME3_P]
HB20_N: J9.f38 ; port TDCOUT1.FRAME2_P  [project net FRAME2_P]
HB20_P: J9.f37 ; port TDCOUT1.SDO2_N
HB21_N: J9.e37
HB21_P: J9.e36 ; port TDCOUT1.FRAME2_N  [project net FRAME2_N]
LA00_CC_N: J9.g7 ; port ADC_OUT0.ADCLK_N  [project net ADCLK_N]
LA00_CC_P: J9.g6 ; port ADC_OUT0.ADCLK_P  [project net ADCLK_P]
LA01_CC_N: J9.d9 ; port ADC_OUT0.LCLK_N
LA01_CC_P: J9.d8 ; port ADC_OUT0.LCLK_P
LA02_N: J9.h8 ; port ADC_OUT0.OUT0_N
LA02_P: J9.h7 ; port ADC_OUT0.OUT0_P
LA03_N: J9.g10 ; port ADC_OUT0.OUT1_N
LA03_P: J9.g9 ; port ADC_OUT0.OUT1_P
LA04_N: J9.h11 ; port ADC_OUT0.OUT2_N
LA04_P: J9.h10 ; port ADC_OUT0.OUT2_P
LA05_N: J9.d12 ; port ADC_OUT0.OUT3_N
LA05_P: J9.d11 ; port ADC_OUT0.OUT3_P
LA06_N: J9.c11 ; port ADC_OUT0.OUT4_N
LA06_P: J9.c10 ; port ADC_OUT0.OUT4_P
LA07_N: J9.h14 ; port ADC_OUT0.OUT5_N
LA07_P: J9.h13 ; port ADC_OUT0.OUT5_P
LA08_N: J9.g13 ; port ADC_OUT0.OUT6_N
LA08_P: J9.g12 ; port ADC_OUT0.OUT6_P
LA09_N: J9.d15 ; port ADC_OUT0.OUT7_N
LA09_P: J9.d14 ; port ADC_OUT0.OUT7_P
LA10_N: J9.c15 ; port ADC_SSN1_VADJ  [project net ADC_SSN1_VADJ]
LA10_P: J9.c14 ; port ADC_SSN0_VADJ  [project net ADC_SSN0_VADJ]
LA11_N: J9.h17 ; port ADC_MOSI_VADJ  [project net ADC_MOSI_VADJ]
LA11_P: J9.h16 ; port ADC_MISO_VADJ  [project net ADC_MISO_VADJ]
LA12_N: J9.g16 ; port TDC_SSN2_VADJ
LA12_P: J9.g15 ; port TDC_SSN1_VADJ
LA13_N: J9.d18 ; port TDC_SSN0_VADJ
LA13_P: J9.d17 ; port TDC_MOSI_VADJ
LA14_N: J9.c19 ; port TDC_MISO_VADJ
LA14_P: J9.c18 ; port TDC_SCK_VADJ
LA15_N: J9.h20 ; port IDX_IN.SIG_N  [project net IDX_N]
LA15_P: J9.h19 ; port IDX_IN.SIG_P  [project net IDX_P]
LA16_N: J9.g19 ; port TRIG.SIG_N
LA16_P: J9.g18 ; port TRIG.SIG_P
LA17_CC_N: J9.d21 ; port ADC_OUT1.ADCLK_N  [project net ADCLK_N]
LA17_CC_P: J9.d20 ; port ADC_OUT1.ADCLK_P  [project net ADCLK_P]
LA18_CC_N: J9.c23 ; port ADC_OUT1.LCLK_N
LA18_CC_P: J9.c22 ; port ADC_OUT1.LCLK_P
LA19_N: J9.h23 ; port ADC_OUT1.OUT7_N
LA19_P: J9.h22 ; port ADC_OUT1.OUT7_P
LA20_N: J9.g22 ; port ADC_OUT1.OUT6_N
LA20_P: J9.g21 ; port ADC_OUT1.OUT6_P
LA21_N: J9.h26 ; port ADC_OUT1.OUT5_N
LA21_P: J9.h25 ; port ADC_OUT1.OUT5_P
LA22_N: J9.g25 ; port ADC_OUT1.OUT4_N
LA22_P: J9.g24 ; port ADC_OUT1.OUT4_P
LA23_N: J9.d24 ; port ADC_OUT1.OUT3_N
LA23_P: J9.d23 ; port ADC_OUT1.OUT3_P
LA24_N: J9.h29 ; port ADC_OUT1.OUT2_N
LA24_P: J9.h28 ; port ADC_OUT1.OUT2_P
LA25_N: J9.g28 ; port ADC_OUT1.OUT1_N
LA25_P: J9.g27 ; port ADC_OUT1.OUT1_P
LA26_N: J9.d27 ; port ADC_OUT1.OUT0_N
LA26_P: J9.d26 ; port ADC_OUT1.OUT0_P
LA27_N: J9.c27 ; port CLK_SEL_VADJ
LA27_P: J9.c26 ; port TRIG_TERM_VADJ
LA28_N: J9.h32 ; port ADC_SCK_VADJ, port SDA_VADJ  [project net ADC_SCK_VADJ]
LA28_P: J9.h31 ; port TDC_SSN3_VADJ, port SCL_VADJ
LA29_N: J9.g31 ; port PGOOD_VADJ
LA29_P: J9.g30 ; port ADC_SYNC_VADJ
LA30_N: J9.h35
LA30_P: J9.h34
LA31_N: J9.g34 ; port REF_SEL_VADJ
LA31_P: J9.g33 ; port ADC_RESETn_VADJ
LA32_N: J9.h38
LA32_P: J9.h37
LA33_N: J9.g37 ; port TRIG_DIR_VADJ
LA33_P: J9.g36 ; port IDX_SRC_SEL_VADJ
PG_M2C: J9.f1
REFA_N: R27.1 ; port FMC_REFCLK_N
REFA_P: R23.1 ; port FMC_REFCLK_P
SCL: J9.c30 ; port SCL
SDA: J9.c31 ; port SDA
TDI: J9.d30 J9.d31
VIO_B_M2C: J9.k40
VREF_A_M2C: J9.h1

Not connected (* = marked no-connect by the designer): J9 a2* a3* a6* a7* a10* a11* a14* a15* a18* a19* a22* a23* a26* a27* a30* a31* a34* a35* a38* a39* b4* b5* b8* b9* b12* b13* b16* b17* b20* b21* b24* b25* b28* b29* b32* b33* b36* b37* b40* c2* c3* c6* c7* d1* d4* d5* d29* d33* d34* j39 k1*

### Buses and harness runs
bus TDC_INT_VADJ[3..0] = port TDC_INT_VADJ[3..0]
bus TDC_PAR_VADJ[3..0] = port TDC_PAR_VADJ[3..0]

### Layout directives
differential pair: CLK3_BIDIR_N, CLK3_BIDIR_P

### Notes on the sheet
- DP1_M2C_P
- DP1_M2C_N
- DPO_C2M_P
- DPO_C2M_N
- PG_C2M
- GBTCLK0_M2C_P
- DP2_M2C_P
- DP2_M2C_N
- DPO_M2C_P
- DPO_M2C_N
- GBTCLK0_M2C_N
- DP3_M2C_P
- DP3_M2C_N
- DP4_M2C_P
- DP4_M2C_N
- DP5_M2C_P
- DP5_M2C_N
- DP1_C2M_P
- DP1_C2M_N
- DP2_C2M_P
- DP2_C2M_N
- DP3_C2M_P
- DP3_C2M_N
- (near J9) TDO
- DP4_C2M_P
- DP4_C2M_N
- DP5_C2M_P
- DP5_C2M_N
- RES0
- (near J9) PRSNT_M2C_L
- EEPROM
- (near B1) Check the right pin to route CLK signals and reference clock signals...
- Labels drawn without touching a wire or pin: CLK2_BIDIR_N, CLK2_BIDIR_P, HA17_CC_N, HA17_CC_P, HA19_N, HA19_P, HB21_N, LA30_N, LA30_P, LA32_N, LA32_P, VIO_B_M2C
- Project/Equipment
- Document
- Designer
- Drawn by
- Check.by
- Copyright WUT ISE 2018.
  This documentation describes Open Hardware and is licensed under the CERN OHL v.1.1. You may redistribute and modify this documentation under the terms of the CERN OHL v.1.1. (http://ohwr.org/CERNOHL). This documentation is distributed WITHOUT ANY EXPRESS OR IMPLIED WARRANTY, INCLUDING OF MERCHANTABILITY, SATISFACTORY QUALITY AND FITNESS FOR A PARTICULAR PURPOSE. Please see the CERN OHL v.1.1 for applicable conditions.
- Contact
- File
- Last Mod.
- Print Date
- Sheet
- Size
- A3
- of
- Rev
- (in symbol R0402_0R_JUMPER) 1%
- (in symbol R0603_4K7_1%_0.1W_100PPM) 1%

### Library data of the parts
B1-B4 = PLATED_HOLE3.0_PAD6.0: Single Terminal Socket; Part Description: Plated Through Hole: Hole Dia.=3.0mm Pad Dia.=6.0mm; Mounted: No; Table: Pads; Part Number: PLATED_HOLE3.0_PAD6.0; Component Kind: Standard (No BOM); Component Type: Standard (No BOM); Designator: Single Terminal Socket; Library Reference: Single Terminal Socket; Pin Count: 1; Family: Plated Hole; Socket: No; SMD: No; Status: None; ComponentHeight: 0mm; Author: CERN DEM JLC; CreateDate: 26.05.2008; LatestRevisionDate: 26.05.2008; PackageDescription: Plated Through Hole: Hole Dia.=3.0mm Pad Dia.=6.0mm
J9 = SAMTEC_ASP-134488-01: Connector VITA 57, 400 Male contacts in 10 row abcdefghj; Part Description: 400 contacts (10 rows abcdefghj) Surface Mount Male Connector, VITA 57 (MC-HPC-10); Manufacturer: SAMTEC; Part Number: SAMTEC_ASP-134488-01; Component Kind: Standard; Component Type: Standard; Pin Count: 400; Family: VITA 57; Mounted: Yes; Socket: No; SMD: Yes; Status: None; Manufacturer Part Number: ASP-134488-01; ComponentHeight: 6.1mm; HelpURL: \\cern.ch\dfs\Applications\Altium\Datasheets\SAMTEC_ASP-134488-01.pdf; Author: CERN DEM JLC; CreateDate: 30/04/2009; LatestRevisionDate: 17/08/2009; Table: SAMTEC
R23 R27 = R0402_0R_JUMPER: Resistor - 1%; Part Description: 1A (0.05R Max DC Resistance) Zero Ohm Jumper; Manufacturer: GENERIC; Manufacturer1 Part Number: 232270591001L; Table: Resistors SMD; Part Number: R0402_0R_JUMPER; Component Kind: Standard; Component Type: Standard; Pin Count: 2; Value: 0; Status: Not recommended; Manufacturer Part Number: R0402_0R_JUMPER; Case: 0402; Mounted: Yes; Socket: No; SMD: Yes; Manufacturer1 Example: YAGEO PHYCOMP; Manufacturer1 ComponentHeight: 0.4mm; HelpURL: \\cern.ch\dfs\Applications\Altium\Datasheets\R0402_Phycomp_RC0402.pdf; Author: CERN DEM JLC; CreateDate: 3/12/2007; LatestRevisionDate: 17/10/2012
R74 = R0603_4K7_1%_0.1W_100PPM: Resistor - 1%; Part Description: General Purpose Thick Film Chip Resistor; Manufacturer: GENERIC; Manufacturer1 Part Number: NRC06F4701TRF; Power: 0.1W; TC: ±100ppm/°C; Table: Resistors SMD; Part Number: R0603_4K7_1%_0.1W_100PPM; Component Kind: Standard; Component Type: Standard; Pin Count: 2; Value: 4k7; Status: Preferred; Tolerance: ±1%; Manufacturer Part Number: R0603_4K7_1%_0.1W_100PPM; Case: 0603; Mounted: Yes; Socket: No; SMD: Yes; Manufacturer1 Example: NIC COMPONENT; Manufacturer1 ComponentHeight: 0.55mm; HelpURL: \\cern.ch\dfs\Applications\Altium\Datasheets\R0603_NIC_NRC.pdf; Author: CERN DEM JLC; CreateDate: 03/12/2007; LatestRevisionDate: 13/03/2008